# EAGLE schematic GND_SATION_PCB_1.01_ (EAGLE 9.6.2)
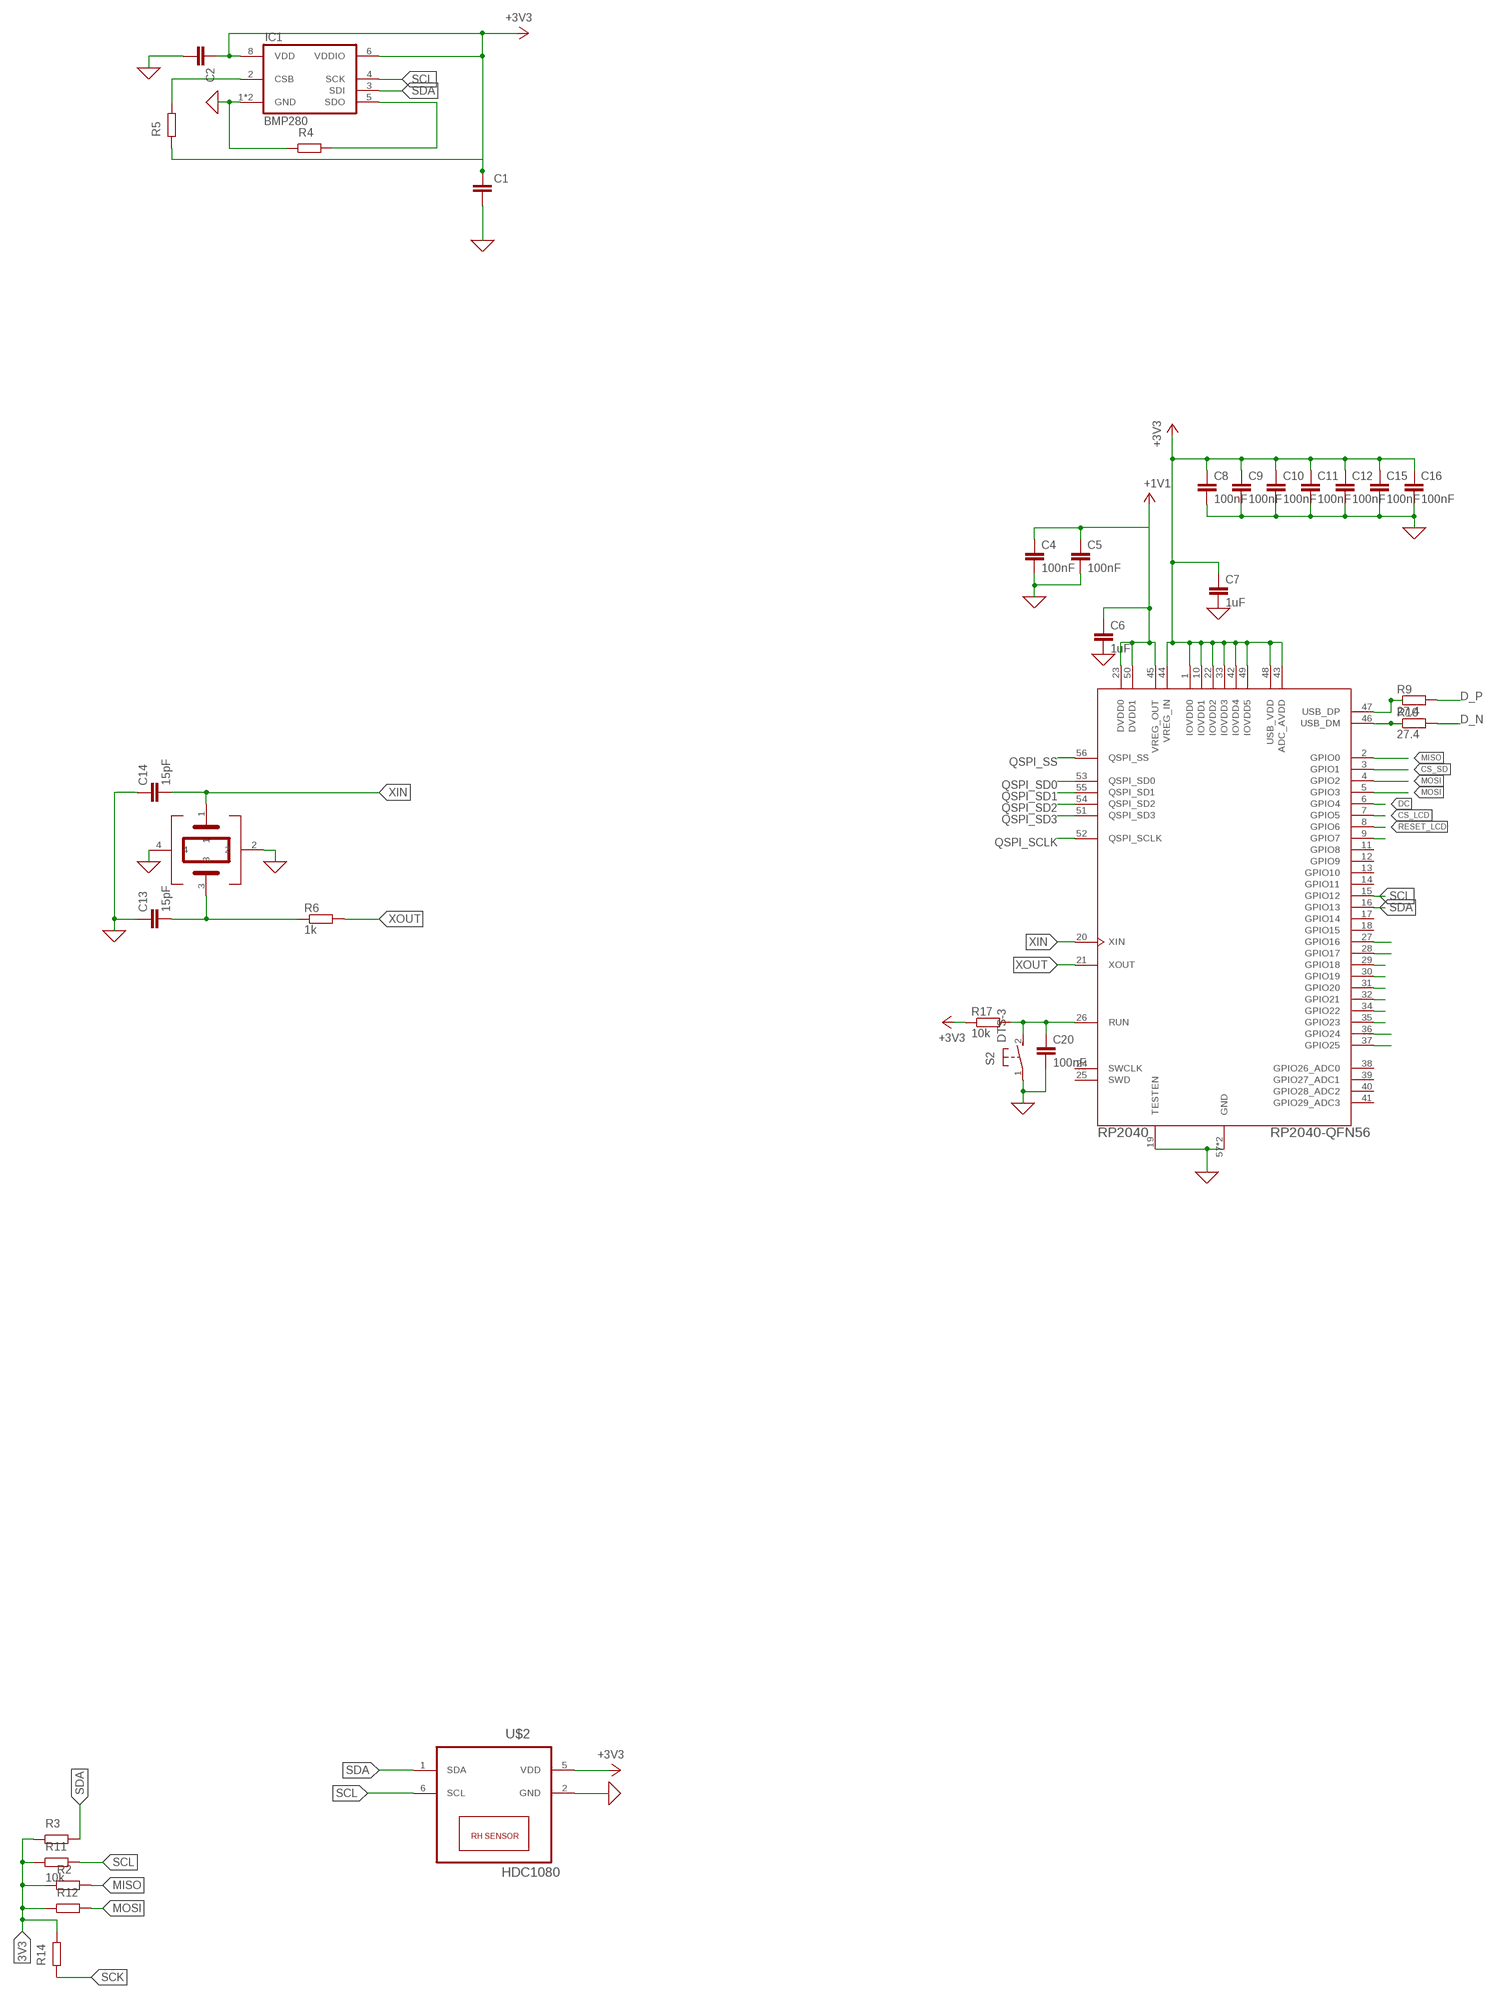
[diagram p0: schematic, sheet 1, part 1 of 2]
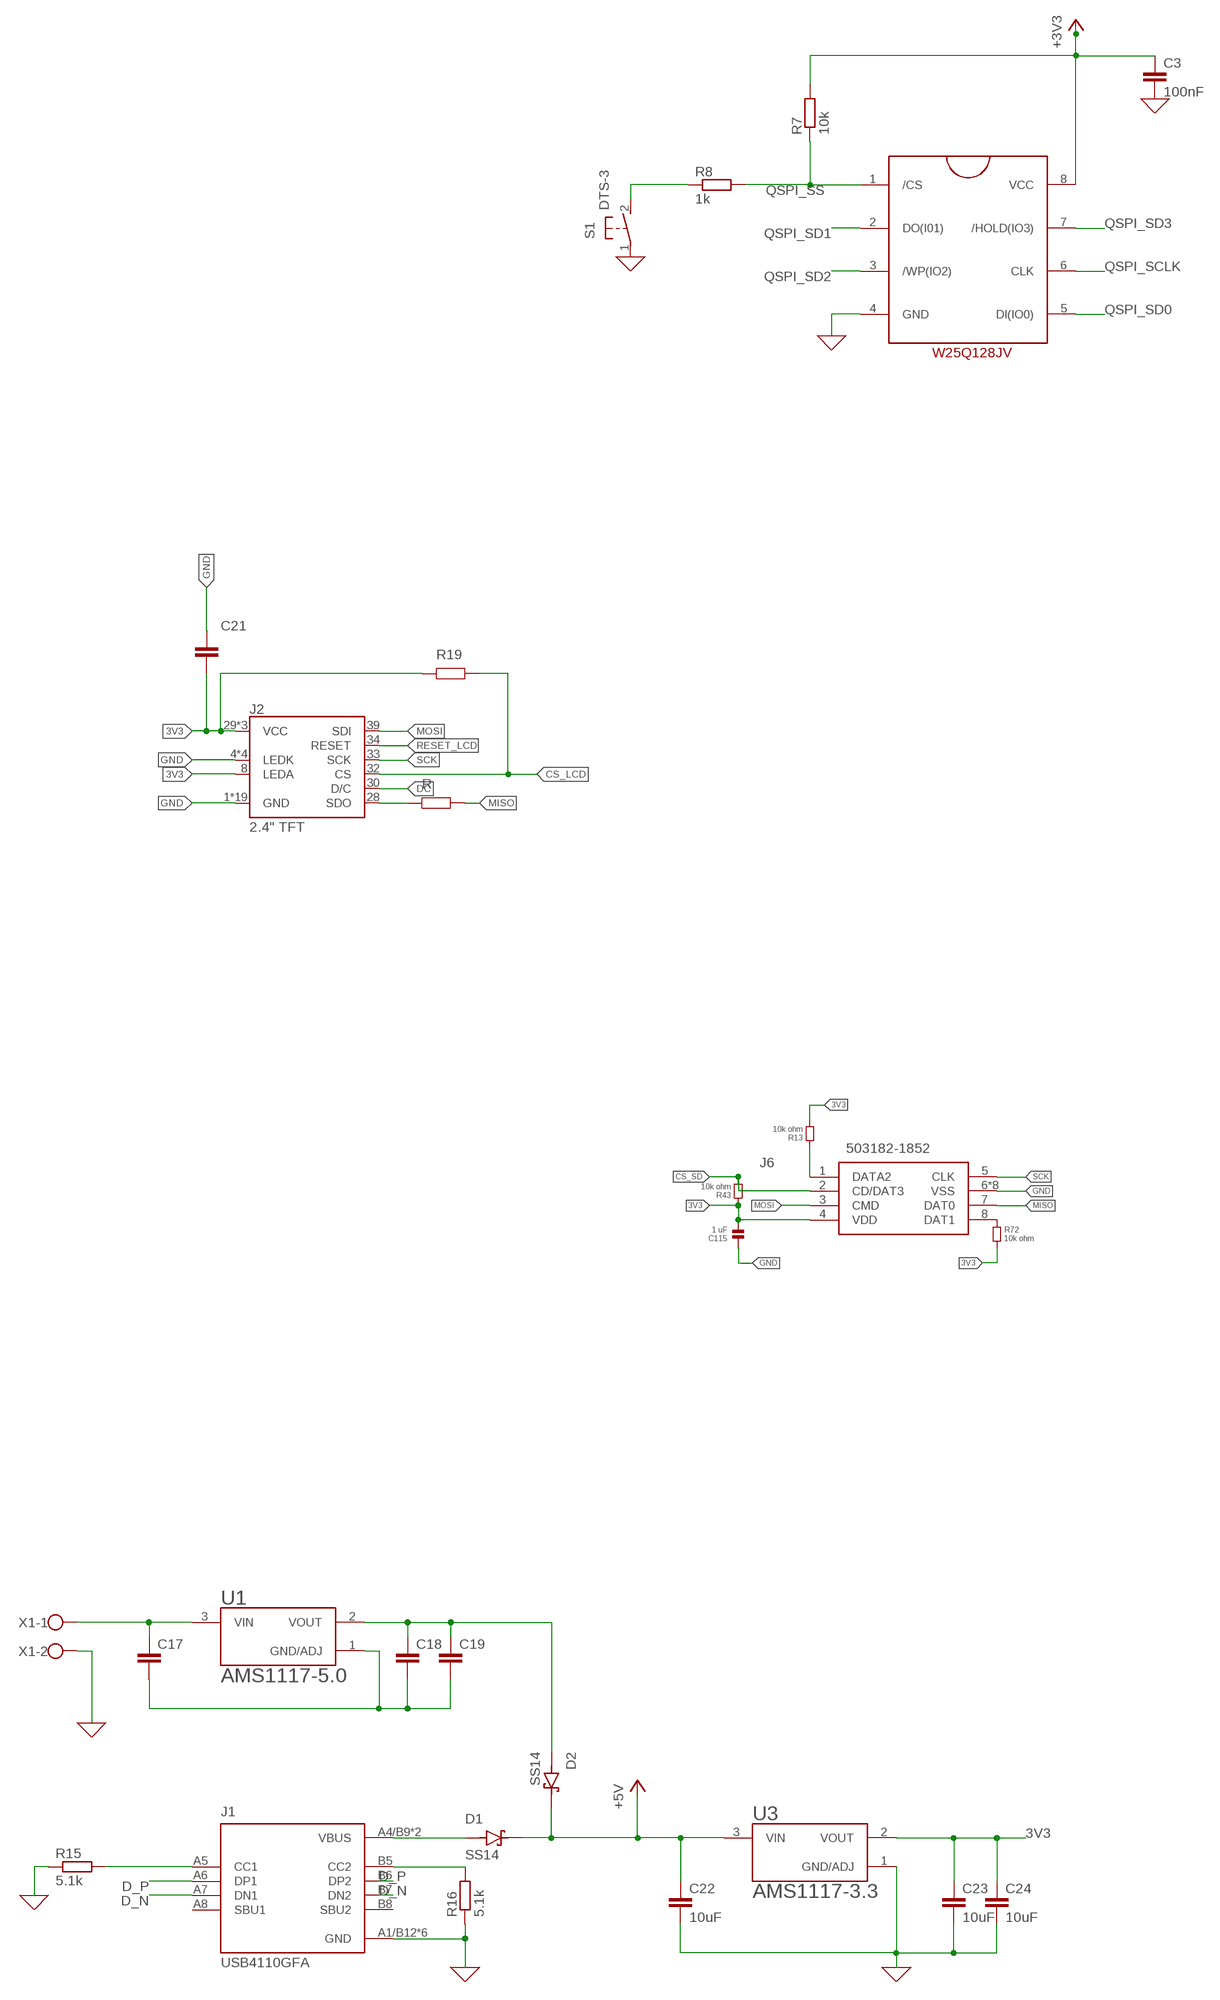
[diagram p1: schematic, sheet 1, part 2 of 2]

## Parts
C1  C  (no package)
C2  C  (no package)
C3  100nF  C-EUC0603  [C0603]
C4  100nF  C-EUC0603  [C0603]
C5  100nF  C-EUC0603  [C0603]
C6  1uF  C-EUC0603  [C0603]
C7  1uF  C-EUC0603  [C0603]
C8  100nF  C-EUC0603  [C0603]
C9  100nF  C-EUC0603  [C0603]
C10  100nF  C-EUC0603  [C0603]
C11  100nF  C-EUC0603  [C0603]
C12  100nF  C-EUC0603  [C0603]
C13  15pF  C-EUC0603  [C0603]
C14  15pF  C-EUC0603  [C0603]
C15  100nF  C-EUC0603  [C0603]
C16  100nF  C-EUC0603  [C0603]
C17  C-EUC0603  [C0603]
C18  C-EUC0603  [C0603]
C19  C-EUC0603  [C0603]
C20  100nF  C-EUC0603  [C0603]
C21  C_CHIP-0402(1005-METRIC)  [CAPC1005X60]
C22  10uF  C-EUC0603  [C0603]
C23  10uF  C-EUC0603  [C0603]
C24  10uF  C-EUC0603  [C0603]
C115  1 uF  CAPACITOR.0603  [0603]
D1  SS14  [DIOM4325X250N]
D2  SS14  [DIOM4325X250N]
IC1  BMP280  [BMP280]
J1  USB4110GFA  [GCT_USB4110GFA]
J2  2.4" TFT  4DLCD-24-320X240  [FPC05040-17204]
J6  503182-1852  [5031821852]
R  R  (no package)
R2  R  (no package)
R3  R  (no package)
R4  R  (no package)
R5  R  (no package)
R6  1k  R-EU_R0603  [R0603]
R7  10k  R-EU_R0603  [R0603]
R8  1k  R-EU_R0603  [R0603]
R9  27.4  R-EU_R0603  [R0603]
R10  27.4  R-EU_R0603  [R0603]
R11  10k  R  (no package)
R12  R  (no package)
R13  10k ohm  RESISTOR.0603  [0603]
R14  R  (no package)
R15  5.1k  R-EU_R0603  [R0603]
R16  5.1k  R-EU_R0603  [R0603]
R17  10k  R-EU_R0603  [R0603]
R19  R  (no package)
R43  10k ohm  RESISTOR.0603  [0603]
R72  10k ohm  RESISTOR.0603  [0603]
RP2040  RP2040-QFN56  [RP2040-QFN-56]
S1  DTS-3  [DTS-3]
S2  DTS-3  [DTS-3]
U1  AMS1117-5.0  [SOT229P700X180-4N]
U2  SOIC127P790X216-8NW25Q128JVJSQ  [SOIC127P790X216-8N]
U3  AMS1117-3.3  [SOT229P700X180-4N]
U$1  ABM8-272-T3  [ABM8-272-T3]
U$2  HDC1080  [TI-S-PWSON-N6]
X1  W237-102  [W237-102]

## Nets
0: C1.2 C2.2 C3.2 C4.2 C5.2 C6.2 C7.2 C8.2 C9.2 C10.2 C11.2 C12.2 C13.1 C14.1 C15.2 C16.2 C20.2 C22.2 C23.2 C24.2 IC1.1(GND) IC1.7(GND) J1.A1/B12(GND) J1.B1/A12(GND) J1.S1(GND) J1.S2(GND) J1.S3(GND) J1.S4(GND) R4.1 R15.1 R16.1 RP2040.19(TESTEN) RP2040.57(GND) RP2040.62(GND) S1.1 S2.1 U2.4(GND) U3.1(GND/ADJ) U$1.2 U$1.4 U$2.2(GND) X1.2 ; supply symbol labelled GND
1V1: C4.1 C5.1 C6.1 RP2040.23(DVDD0) RP2040.45(VREG_OUT) RP2040.50(DVDD1) ; supply symbol labelled +1V1
3V3: C21.2 C23.1 C24.1 C115.2 J2.8(LEDA) J2.29(VCC) J2.31(VCC) J2.38(VCC) J6.4(VDD) R2.1 R3.1 R11.1 R12.1 R13.2 R14.2 R19.1 R43.1 R72.2 U3.2(VOUT)
+3V3: C1.1 C2.1 C3.1 C7.1 C8.1 C9.1 C10.1 C11.1 C12.1 C15.1 C16.1 IC1.6(VDDIO) IC1.8(VDD) R5.1 R7.2 R17.1 RP2040.1(IOVDD0) RP2040.10(IOVDD1) RP2040.22(IOVDD2) RP2040.33(IOVDD3) RP2040.42(IOVDD4) RP2040.43(ADC_AVDD) RP2040.44(VREG_IN) RP2040.48(USB_VDD) RP2040.49(IOVDD5) U2.8(VCC) U$2.5(VDD)
+5V: C22.1 D1.C(K) D2.C(K) U3.3(VIN)
CS_LCD: J2.32(CS) R19.2 RP2040.7(GPIO5)
CS_SD: J6.2(CD/DAT3) R43.2 RP2040.3(GPIO1)
D_N: J1.A7(DN1) J1.B7(DN2) R10.2
D_P: J1.A6(DP1) J1.B6(DP2) R9.2
DC: J2.30(D/C) RP2040.6(GPIO4)
DROGUE: RP2040.29(GPIO18)
FIN_1: RP2040.9(GPIO7)
GND: C21.1 C115.1 J2.1(GND) J2.4(LEDK) J2.5(LEDK) J2.6(LEDK) J2.7(LEDK) J2.11(GND) J2.12(GND) J2.13(GND) J2.14(GND) J2.15(GND) J2.16(GND) J2.17(GND) J2.18(GND) J2.19(GND) J2.20(GND) J2.21(GND) J2.22(GND) J2.23(GND) J2.24(GND) J2.25(GND) J2.26(GND) J2.27(GND) J2.40(GND) J6.6(VSS) J6.9(VSS) J6.10(VSS) J6.11(VSS) J6.12(VSS) J6.13(VSS) J6.14(VSS) J6.15(VSS)
GPS_RX: RP2040.27(GPIO16)
GPS_TX: RP2040.28(GPIO17)
IGN1: RP2040.31(GPIO20)
IGN2: RP2040.32(GPIO21)
MAIN: RP2040.30(GPIO19)
MISO: J6.7(DAT0) R2.2 R.2 RP2040.2(GPIO0)
MOSI: J2.39(SDI) J6.3(CMD) R12.2 RP2040.4(GPIO2) RP2040.5(GPIO3)
N$1: IC1.5(SDO) R4.2
N$2: C17.2 C18.2 C19.2 U1.1(GND/ADJ)
N$3: IC1.2(CSB) R5.2
N$4: C13.2 R6.1 U$1.3
N$5: R8.1 S1.2
N$6: R9.1 RP2040.47(USB_DP)
N$7: R10.1 RP2040.46(USB_DM)
N$8: J6.1(DATA2) R13.1
N$9: D1.A J1.A4/B9(VBUS) J1.B4/A9(VBUS)
N$10: C18.1 C19.1 D2.A U1.2(VOUT)
N$11: J1.A5(CC1) R15.2
N$12: J6.8(DAT1) R72.1
N$13: J2.28(SDO) R.1
N$14: C20.1 R17.2 RP2040.26(RUN) S2.2
N$15: J1.B5(CC2) R16.2
N$16: C17.1 U1.3(VIN) X1.1
QSPI_SCLK: RP2040.52(QSPI_SCLK) U2.6(CLK)
QSPI_SD0: RP2040.53(QSPI_SD0) U2.5(DI(IO0))
QSPI_SD1: RP2040.55(QSPI_SD1) U2.2(DO(I01))
QSPI_SD2: RP2040.54(QSPI_SD2) U2.3(/WP(IO2))
QSPI_SD3: RP2040.51(QSPI_SD3) U2.7(/HOLD(IO3))
QSPI_SS: R7.1 R8.2 RP2040.56(QSPI_SS) U2.1(/CS)
RESET_LCD: J2.34(RESET) RP2040.8(GPIO6)
RSSI: RP2040.35(GPIO23)
SCK: J2.33(SCK) J6.5(CLK) R14.1
SCL: IC1.4(SCK) R11.2 RP2040.15(GPIO12) U$2.6(SCL)
SDA: IC1.3(SDI) R3.2 RP2040.16(GPIO13) U$2.1(SDA)
TEL_RST: RP2040.34(GPIO22)
TEL_RX: RP2040.36(GPIO24)
TEL_TX: RP2040.37(GPIO25)
XIN: C14.2 RP2040.20(XIN) U$1.1
XOUT: R6.2 RP2040.21(XOUT)
Unconnected: J1.A8(SBU1) J1.B8(SBU2) RP2040.11(GPIO8) RP2040.12(GPIO9) RP2040.13(GPIO10) RP2040.14(GPIO11) RP2040.17(GPIO14) RP2040.18(GPIO15) RP2040.24(SWCLK) RP2040.25(SWD) RP2040.38(GPIO26_ADC0) RP2040.39(GPIO27_ADC1) RP2040.40(GPIO28_ADC2) RP2040.41(GPIO29_ADC3)

## Library data of the parts
C1 C2 = ngspice-simulation:C: CAPACITOR
C3-C20 C22-C24 = rcl:C-EU: CAPACITOR, European symbol; SPICEPREFIX: C
C21 = Capacitor:C: Capacitor - Generic; CATEGORY: Capacitor; PACKAGE_SIZE: 0402; PACKAGE_TYPE: SMD; SUBCATEGORY: Ceramic Capacitors; TYPE: MLCC
C115 = standardparts:CAPACITOR
D1 D2 = SS14:SS14: Check availability <https://pricing.snapeda.com/parts/SS14/Taiwan%20Semiconductor/view-part?ref=eda>; AVAILABILITY: In Stock; CHECK_PRICES: https://www.snapeda.com/parts/SS14/taiwan/view-part/?ref=eda; DESCRIPTION: 1A, 40V, Schottky Rectifier; MF: Taiwan Semiconductor; MP: SS14; PACKAGE: SMA-2 Taiwan Semiconductor; PRICE: None; SNAPEDA_LINK: https://www.snapeda.com/parts/SS14/taiwan/view-part/?ref=snap
IC1 = BMP280-standalone:BMP280: The BMP280 is an absolute barometric pressure sensor especially designed for mobile applications. The sensor module is housed in an extremely compact 8-pin metal-lid LGA package with a footprint of only 2.0 × 2.5 mm2 and 0.95 mm package height. Its small dimensions and its low power consumption of 2.7 μA @1Hz allow the implementation in battery driven devices such as mobile phones, GPS modules or watches. The library has been designed by Richard Magdycz <https://www.facebook.com/groups/eaglecadsoftUK>
J1 = USB4110GFA:USB4110GFA: Check availability <https://pricing.snapeda.com/parts/USB4110GFA/GCT/view-part?ref=eda>; AVAILABILITY: In Stock; DESCRIPTION: USB-C (USB TYPE-C) USB 2.0 Receptacle Connector 24 (16+8 Dummy) Position Surface Mount, Right Angle; Through Hole; MF: GCT; MP: USB4110GFA; PACKAGE: None; PRICE: None
J2 = SparkFun-Displays:4DLCD-24-320X240: 4D LCD 4DLCD-24320240-IPS - 2.4" 240x320 TFT LCD 4-wire SPI capable TFT display. 36.72 x 48.96mm active area; PROD_ID: LCD-14913; PROD_ID1: CONN-14082
J6 = 503182-1852:503182-1852: Micro SD Normal UltraLowPro8CktEmbsTpPkg Source: Datasheet <https://www.molex.com/pdm_docs/sd/5031821852_sd.pdf>; DESCRIPTION: Micro SD Normal UltraLowPro8CktEmbsTpPkg; HEIGHT: mm; MANUFACTURER_NAME: Molex; MANUFACTURER_PART_NUMBER: 503182-1852
R R2-R5 R11 R12 R14 R19 = ngspice-simulation:R: RESISTOR
R6-R10 R15-R17 = rcl:R-EU_: RESISTOR, European symbol; SPICEPREFIX: R
R13 R43 R72 = standardparts:RESISTOR
RP2040 = RpiPico:RP2040-QFN56
S1 S2 = DTS-3:DTS-3: Check availability <https://pricing.snapeda.com/parts/DTS-3/APEM%20Inc./view-part?ref=eda>; AVAILABILITY: Not in stock; CHECK_PRICES: https://www.snapeda.com/parts/DTS-3/APEM/view-part/?ref=eda; DESCRIPTION: Tactile Switch SPST-NO Top Actuated Through Hole; MF: APEM Inc.; MP: DTS-3; PACKAGE: DIP-10 APEM Inc.; PRICE: None; SNAPEDA_LINK: https://www.snapeda.com/parts/DTS-3/APEM/view-part/?ref=snap
U1 = AMS1117-5.0:AMS1117-5.0: Check availability <https://pricing.snapeda.com/parts/AMS1117-5.0/Advanced%20Monolithic%20Systems/view-part?ref=eda>; AVAILABILITY: Not in stock; CHECK_PRICES: https://www.snapeda.com/parts/AMS1117-5.0/Advanced+Monolithic+Systems/view-part/?ref=eda; DESCRIPTION: Sot223/Pkg 1-Amp 5-Volt Low Drop Out Voltage Regulatator; MF: Advanced Monolithic Systems; MP: AMS1117-5.0; PACKAGE: SOT-223 Seeed Technology; PRICE: None; SNAPEDA_LINK: https://www.snapeda.com/parts/AMS1117-5.0/Advanced+Monolithic+Systems/view-part/?ref=snap
U2 = SOIC127P790X216-8N:SOIC127P790X216-8N
U3 = AMS1117-3.3:AMS1117-3.3: Check availability <https://pricing.snapeda.com/parts/AMS1117-3.3/Advanced%20Monolithic%20Systems/view-part?ref=eda>; AVAILABILITY: Not in stock; CHECK_PRICES: https://www.snapeda.com/parts/AMS1117-3.3/Advanced+Monolithic+Systems/view-part/?ref=eda; DESCRIPTION: Sot223/Pkg 1-Amp 3.3-Volt Low Drop Out Voltage Regulatator; MF: Advanced Monolithic Systems; MP: AMS1117-3.3; PACKAGE: SOT-223 Seeed Technology; PRICE: None; SNAPEDA_LINK: https://www.snapeda.com/parts/AMS1117-3.3/Advanced+Monolithic+Systems/view-part/?ref=snap
U$1 = ABM8-272-T3:ABM8-272-T3: Check availability <https://pricing.snapeda.com/parts/ABM8-272-T3/ABRACON/view-part?ref=eda>; AVAILABILITY: In Stock; CHECK_PRICES: https://www.snapeda.com/parts/ABM8-272-T3/Abracon/view-part/?ref=eda; DESCRIPTION: 12 MHz ±30ppm Crystal 10pF 50 Ohms 4-SMD, No Lead; MF: ABRACON; MP: ABM8-272-T3; PACKAGE: NON-STANDARD-4 Abracon; PRICE: None; SNAPEDA_LINK: https://www.snapeda.com/parts/ABM8-272-T3/Abracon/view-part/?ref=snap
U$2 = Texas-HDC1080:HDC1080
X1 = con-wago-500:W237-102: WAGO SCREW CLAMP; MPN: 237-102; OC_FARNELL: unknown; OC_NEWARK: 70K9898